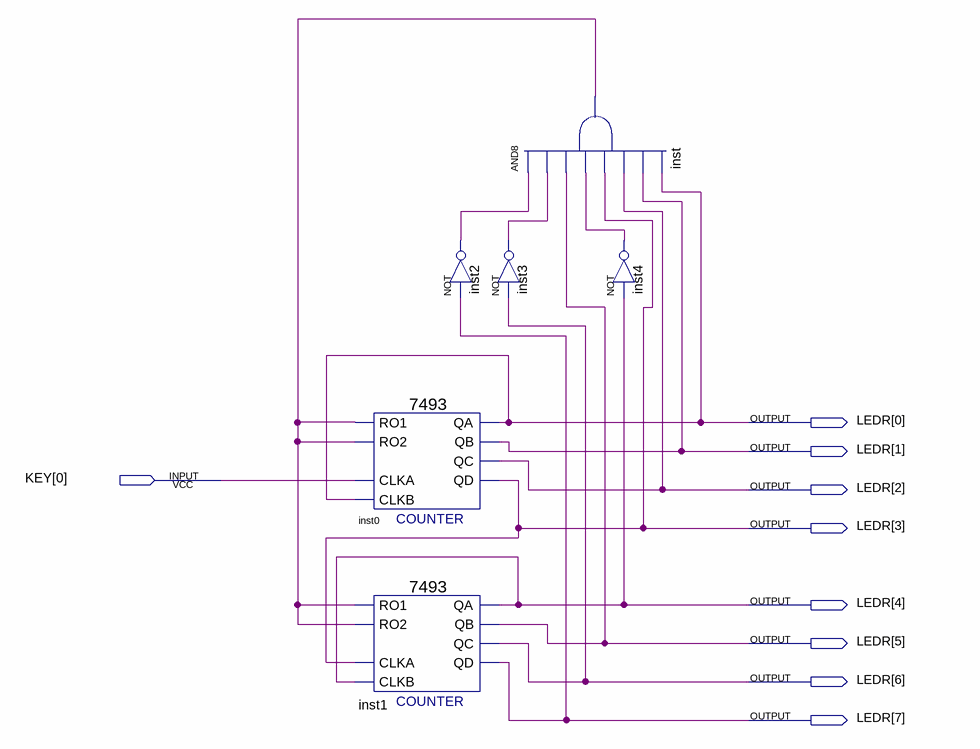
[diagram p0: schematic sheet]
// Quartus schematic lab31.bdf as structural Verilog: 6 symbols, 9 pins
module lab31 (
  input  [0:0] KEY,
  output [7:0] LEDR
);

  wire inst2_out, inst3_out, inst4_out, inst_out;

  \7493  inst0 (
    .RO1(inst_out), .RO2(inst_out), .CLKA(KEY[0]), .CLKB(LEDR[0]), .QC(LEDR[2]), .QB(LEDR[1]), .QA(LEDR[0]),
    .QD(LEDR[3]));
  \7493  inst1 (
    .RO1(inst_out), .RO2(inst_out), .CLKA(LEDR[3]), .CLKB(LEDR[4]), .QC(LEDR[6]), .QB(LEDR[5]), .QA(LEDR[4]),
    .QD(LEDR[7]));
  not inst2 (inst2_out, LEDR[7]);
  and inst (inst_out, inst2_out, inst3_out, LEDR[5], inst4_out, LEDR[3], LEDR[2], LEDR[1], LEDR[0]);
  not inst3 (inst3_out, LEDR[6]);
  not inst4 (inst4_out, LEDR[4]);
endmodule
